# EAGLE design main_board_v2.3 (EAGLE 7.7.0)
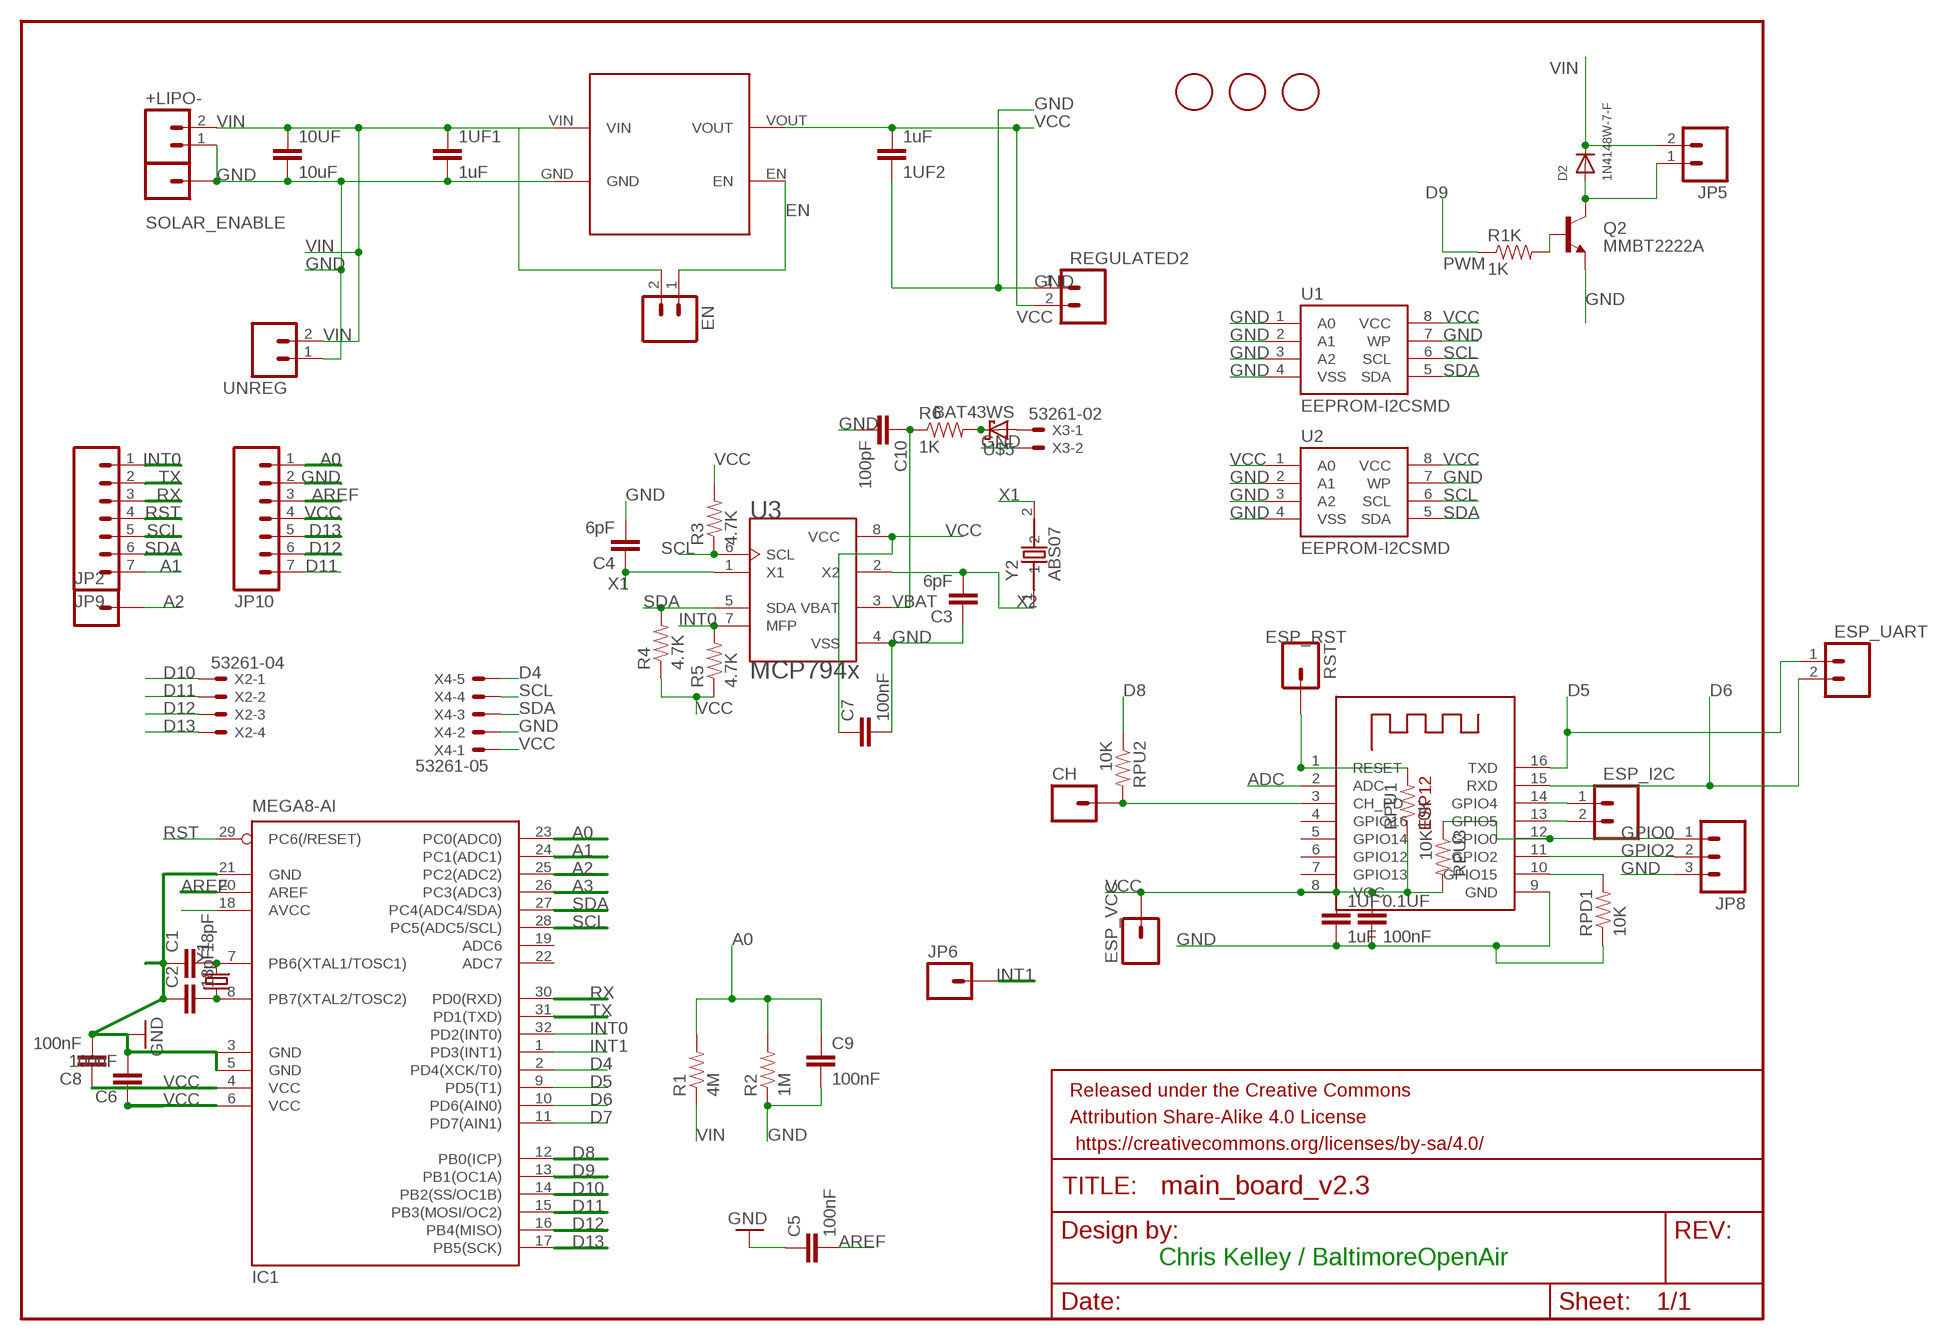
[diagram p0: schematic, sheet 1]

## Parts
0.1UF  100nF  CAP0603-CAP  [0603-CAP]
1UF  1uF  CAP0603-CAP  [0603-CAP]
1UF1  1uF  CAP0603-CAP  [0603-CAP]
1UF2  1uF  CAP0603-CAP  [0603-CAP]
10UF  10uF  CAP0805  [0805]
+LIPO-  M02PTH  [1X02]
C1  18pF  CAP0603-CAP  [0603-CAP]
C2  18pF  CAP0603-CAP  [0603-CAP]
C3  6pF  CAP0603-CAP  [0603-CAP]
C4  6pF  CAP0603-CAP  [0603-CAP]
C5  100nF  CAP0603-CAP  [0603-CAP]
C6  100nF  CAP0603-CAP  [0603-CAP]
C7  100nF  CAP0603-CAP  [0603-CAP]
C8  100nF  CAP0603-CAP  [0603-CAP]
C9  100nF  CAP0603-CAP  [0603-CAP]
C10  100pF  CAP0603-CAP  [0603-CAP]
CH  M01PTH  [1X01]
D2  1N4148W-7-F  DIODESOD-123  [SOD-123]
EN  M02PTH  [1X02]
ESP_I2C  M02PTH  [1X02]
ESP_UART  M02PTH  [1X02]
ESP_VCC  M01PTH  [1X01]
FRAME1  FRAME-LETTER  [CREATIVE_COMMONS]
IC1  MEGA8-AI  [TQFP32-08]
JP2  M01PTH  [1X01]
JP5  M02-JST-2MM-SMT  [JST-2-SMD]
JP6  M01PTH  [1X01]
JP8  M03PTH  [1X03]
JP9  M07  [1X07]
JP10  M07  [1X07]
Q2  MMBT2222A  TRANSISTOR_NPNMMBT2222A  [SOT23-3]
R1  4M  RESISTOR0603  [0603-RES]
R1K  1K  RESISTOR0603-RES  [0603-RES]
R2  1M  RESISTOR0603  [0603-RES]
R3  4.7K  RESISTOR0603-RES  [0603-RES]
R4  4.7K  RESISTOR0603-RES  [0603-RES]
R5  4.7K  RESISTOR0603-RES  [0603-RES]
R6  1K  RESISTOR0603-RES  [0603-RES]
REGULATED2  M02PTH  [1X02]
RPD1  10K  RESISTOR0603-RES  [0603-RES]
RPU1  10K  RESISTOR0603-RES  [0603-RES]
RPU2  10K  RESISTOR0603-RES  [0603-RES]
RPU3  10K  RESISTOR0603-RES  [0603-RES]
RST  M01PTH  [1X01]
SOLAR_ENABLE  M01PTH  [1X01]
U1  EEPROM-I2CSMD  [SO08]
U2  EEPROM-I2CSMD  [SO08]
U3  MCP794x  MCP7940M-I/SN  [SOIC127P600X175-8N]
U$3  FIDUCIAL  [FIDUCIAL_1MM]
U$4  AP2112K  [AP2112K-SOT23-5]
U$5  BAT43WS  [BAT43WS]
U$6  FIDUCIAL  [FIDUCIAL_1MM]
U$7  FIDUCIAL  [FIDUCIAL_1MM]
UNREG  M02PTH  [1X02]
X1  ESP-12  [ESP-12]
X2  53261-04  [53261-04]
X3  53261-02  [53261-02]
X4  53261-05  [53261-05]
Y1  CRYSTAL5X3  [CRYSTAL-SMD-5X3]
Y2  ABS07  ABS07-32.768KHZ-T  [XTAL320X150X90]

## Nets
A0: C9.1 IC1.23(PC0(ADC0)) JP10.1 R1.2 R2.2
A1: IC1.24(PC1(ADC1)) JP9.7
A2: IC1.25(PC2(ADC2)) JP2.1
A3: IC1.26(PC3(ADC3))
ADC: X1.2(ADC)
AREF: C5.2 IC1.20(AREF) JP10.3
CH_PD: CH.1 RPU2.2 X1.3(CH_PD)
D4: IC1.2(PD4(XCK/T0)) X4.5
D5: ESP_UART.1 IC1.9(PD5(T1)) X1.16(TXD)
D6: ESP_UART.2 IC1.10(PD6(AIN0)) X1.15(RXD)
D7: IC1.11(PD7(AIN1))
D8: IC1.12(PB0(ICP)) RPU2.1
D9: IC1.13(PB1(OC1A)) R1K.1
D10: IC1.14(PB2(SS/OC1B)) X2.1
D11: IC1.15(PB3(MOSI/OC2)) JP10.7 X2.2
D12: IC1.16(PB4(MISO)) JP10.6 X2.3
D13: IC1.17(PB5(SCK)) JP10.5 X2.4
EN: EN.1 U$4.EN
ESP_RST: RPU1.2 RST.1 X1.1(RESET)
GND: 0.1UF.2 1UF1.2 1UF2.1 1UF.2 10UF.2 +LIPO-.1 C1.1 C2.1 C3.1 C4.2 C5.1 C6.2 C7.2 C8.2 C9.2 C10.2 IC1.3(GND) IC1.5(GND) IC1.21(GND) JP8.3 JP10.2 Q2.2(E) R2.1 REGULATED2.1 RPD1.1 SOLAR_ENABLE.1 U1.1(A0) U1.2(A1) U1.3(A2) U1.4(VSS) U1.7(WP) U2.2(A1) U2.3(A2) U2.4(VSS) U2.7(WP) U3.4(VSS) U$4.GND UNREG.1 X1.9(GND) X3.2 X4.2
GPIO0: JP8.1 RPU3.1 X1.12(GPIO0)
GPIO2: JP8.2 X1.11(GPIO2)
GPIO15: RPD1.2 X1.10(GPIO15)
INT0: IC1.32(PD2(INT0)) JP9.1 R5.2 U3.7(MFP)
INT1: IC1.1(PD3(INT1)) JP6.1
N$1: D2.A JP5.1 Q2.3(C)
N$2: U$5.PIN1(C) X3.1
N$3: ESP_I2C.1 X1.14(GPIO4)
N$4: R6.2 U$5.PIN2(A)
N$5: ESP_I2C.2 X1.13(GPIO5)
PWM: Q2.1(B) R1K.2
Q1: C2.2 IC1.8(PB7(XTAL2/TOSC2)) Y1.1
Q2: C1.2 IC1.7(PB6(XTAL1/TOSC1)) Y1.3
RST: IC1.29(PC6(/RESET)) JP9.4
RX: IC1.30(PD0(RXD)) JP9.3
SCL: IC1.28(PC5(ADC5/SCL)) JP9.5 R3.1 U1.6(SCL) U2.6(SCL) U3.6(SCL) X4.4
SDA: IC1.27(PC4(ADC4/SDA)) JP9.6 R4.2 U1.5(SDA) U2.5(SDA) U3.5(SDA) X4.3
TX: IC1.31(PD1(TXD)) JP9.2
VBAT: C10.1 R6.1 U3.3(VBAT)
VCC: 0.1UF.1 1UF2.2 1UF.1 C6.1 C7.1 C8.1 ESP_VCC.1 IC1.4(VCC) IC1.6(VCC) IC1.18(AVCC) JP10.4 R3.2 R4.1 R5.1 REGULATED2.2 RPU1.1 RPU3.2 U1.8(VCC) U2.1(A0) U2.8(VCC) U3.8(VCC) U$4.VOUT X1.8(VCC) X4.1
VIN: 1UF1.1 10UF.1 +LIPO-.2 D2.C EN.2 JP5.2 R1.1 U$4.VIN UNREG.2
X1: C4.1 U3.1(X1) Y2.2
X2: C3.2 U3.2(X2) Y2.1
Unconnected: IC1.19(ADC6) IC1.22(ADC7) X1.4(GPIO16) X1.5(GPIO14) X1.6(GPIO12) X1.7(GPIO13)

## Notes on the sheet
- Chris Kelley / BaltimoreOpenAir

## Library data of the parts
0.1UF 1UF 1UF1 1UF2 10UF C3 C4 C7 C9 C10 = SparkFun-Passives:CAP: Capacitor Standard 0603 ceramic capacitor, and 0.1" leaded capacitor.
+LIPO- EN ESP_I2C ESP_UART REGULATED2 UNREG = SparkFun-Connectors:M02: Standard 2-pin 0.1" header. Use with - straight break away headers ( PRT-00116) - right angle break away headers (PRT-00553) - swiss pins (PRT-00743) - machine pins (PRT-00117) - female headers (PRT-00115) Molex polarized connector foot print use with: PRT-08233 with associated crimp pins and housings. 2.54_SCREWTERM for use with PRT-10571. 3.5mm Screw Terminal footprints for PRT-08084 5mm Screw Terminal footprints for use with PRT-08432
C1 C2 C5 C6 C8 = SparkFun:CAP: Capacitor Standard 0603 ceramic capacitor, and 0.1" leaded capacitor.
CH ESP_VCC JP2 JP6 RST SOLAR_ENABLE = SparkFun-Connectors:M01: Header 1 Standard 1-pin 0.1" header. Use with straight break away headers (SKU : PRT-00116), right angle break away headers (PRT-00553), swiss pins (PRT-00743), machine pins (PRT-00117), and female headers (PRT-00115).
D2 = adafruit:DIODE: Diode SMADIODE - SMA Surface Mount Package 20V 1A Schottky Diode Digikey: 641-1014-6-ND DO-1N4148 - Through Hole Small Current Diode SOD-123 20V 1 A (.5mV Vf) Schottky Diode - Digikey: MBRX120TPMSCT-ND SOD-323 10V 570mA (.38mV Vf, 3ns) Schottky Diode - Digikey: ZLLS410CT-ND SOD-523 30V 30mA Schottky Diode (RB751S-40TE61) - Digikey: RB751S-40TE61CT-ND SOT23-R/W - SOT23 Package (R = Solder Paste/Reflow Ovens, W = Hand-Soldering) BAT54Film 40V 300mA - Digikey: 497-7162-1-ND
FRAME1 = SparkFun-Aesthetics:FRAME-LETTER: Schematic Frame Standard 8.5x11 US Letter frame
IC1 = atmel:MEGA8: MICROCONTROLLER 8 Kbytes FLASH, 1 kbytes SRAM, 512 bytes EEPROM, USART, 6-channel 10 bit ADC, 2-channel 8 bit ADC Pin compatible with Atmega48, ATMega88, ATMega168 Source: avr.lbr; MPN: ATMEGA8-16AU; OC_FARNELL: 9171371; OC_NEWARK: 73M8863
JP5 = SparkFun-Connectors:M02: Standard 2-pin 0.1" header. Use with - straight break away headers ( PRT-00116) - right angle break away headers (PRT-00553) - swiss pins (PRT-00743) - machine pins (PRT-00117) - female headers (PRT-00115) Molex polarized connector foot print use with: PRT-08233 with associated crimp pins and housings. 2.54_SCREWTERM for use with PRT-10571. 3.5mm Screw Terminal footprints for PRT-08084 5mm Screw Terminal footprints for use with PRT-08432; PROD_ID: CONN-11443
JP8 = SparkFun-Connectors:M03: Header 3 Standard 3-pin 0.1" header. Use with straight break away headers (SKU : PRT-00116), right angle break away headers (PRT-00553), swiss pins (PRT-00743), machine pins (PRT-00117), and female headers (PRT-00115). Molex polarized connector foot print use with SKU : PRT-08232 with associated crimp pins and housings.
JP9 JP10 = SparkFun:M07: Header 7 Standard 7-pin 0.1" header. Use with straight break away headers (SKU : PRT-00116), right angle break away headers (PRT-00553), swiss pins (PRT-00743), machine pins (PRT-00117), and female headers (PRT-00115). NOTES ON THE VARIANTS LOCK and LOCK_LONGPADS... This footprint was designed to help hold the alignment of a through-hole component (i.e. 7-pin header) while soldering it into place. You may notice that each hole has been shifted either up or down by 0.005 of an inch from it's more standard position (which is usually a perfectly straight line). This slight alteration caused the pins (the squares in the middle) to touch the edges of the holes. Because they are alternating, it causes a "brace" to hold the header in place. 0.005 has proven to be the perfect amount of "off-center" position when using our standard breakaway headers. Although looks a little odd when you look at the bare footprint, once you have a header in there, the alteration is very hard to notice. Also, if you push a header all the way into place, it is covered up entirely on the bottom side. This idea of altering the position of holes to aid alignment will be further integrated into the Sparkfun Library for other footprints. It can help hold any component with 3 or more connection pins.
Q2 = SparkFun-DiscreteSemi:TRANSISTOR_NPN: Generic NPN BJT MMBT2222A - TRANS-08049 (SOT-23, 1A 40V) MPSA42 - TRANS-09116 (SOT-23, 500mA 300V) MMBT5088LT1G - TRANS-11160 (SOT-23, 50 mA 30V) BC547 - COM-08928 <http://www.sparkfun.com/products/8928> (TO-92 45V 100mA) (1.Collector 2.Base 3.Emitter) 2N3904 - COM-00521 <http://www.sparkfun.com/products/521> (TO-92 40V 200mA) (1.Emitter 2.Base 3.Collector) P2N2222A - COM-12852 <http://www.sparkfun.com/products/12852> (TO-92 40V 600mA) (1.Collector 2.Base 3.Emitter); PROD_ID: TRANS-08049
R1 R2 = SparkFun-Resistors:RESISTOR: Resistor Basic schematic elements and footprints for 0603, 1206, and PTH resistors.
R1K R3-R6 RPD1 RPU1-RPU3 = SparkFun-Passives:RESISTOR: Resistor Basic schematic elements and footprints for 0603, 1206, and PTH resistors.
U1 U2 = SparkFun-DigitalIC:EEPROM-I2C: I2C EEPROM chips, 24LC256 (and others)
U3 = MCP7940M-I_SN:MCP7940M-I/SN: MCP7940M Series 5.5 V 64 byte I2C Real-Time Clock/Calendar with SRAM - SOIC-8; AVAILABILITY: Good; DESCRIPTION: MCP7940M Series 5.5 V 64 byte I2C Real-Time Clock/Calendar with SRAM - SOIC-8; MF: Microchip; MP: MCP7940M-I/SN; PACKAGE: SOIC-8 Microchip; PRICE: 0.62 USD
U$3 U$6 U$7 = adafruit:FIDUCIAL: For use by pick and place machines to calibrate the vision/machine, 1mm By microbuilder.eu
U$4 = TPL5111DDCR:AP2112K
U$5 = BAT43WS:BAT43WS
X1 = adafruit:ESP-12
X2 = con-molex:53?-04: CONNECTOR wire to board 1.25 mm (.049 inch) pitch header; OC_FARNELL: 1125374; OC_NEWARK: unknown
X3 = con-molex:53?-02: CONNECTOR wire to board 1.25 mm (.049 inch) pitch header; OC_FARNELL: 1125373; OC_NEWARK: unknown
X4 = con-molex:53?-05: CONNECTOR wire to board 1.25 mm (.049 inch) pitch header; OC_FARNELL: 1433644; OC_NEWARK: unknown
Y1 = SparkFun:CRYSTAL: Crystals Various standard crystals. Proven footprints. Spark Fun Electronics SKU : COM-00534
Y2 = ABS07-32.768KHZ-T:ABS07-32.768KHZ-T: ABS07 Series 32.768 kHz ±20 ppm 12.5 pF -40 to +85 °C SMT Low Profile Crystal; AVAILABILITY: Good; DESCRIPTION: ABS07 Series 32.768 kHz %C2%B120 ppm 12.5 pF -40 to %2B85 %C2%B0C SMT Low Profile Crystal; MF: Abracon; MP: ABS07-32.768KHZ-T; PACKAGE: 0805 Abracon; PRICE: 0.44 USD

## Board
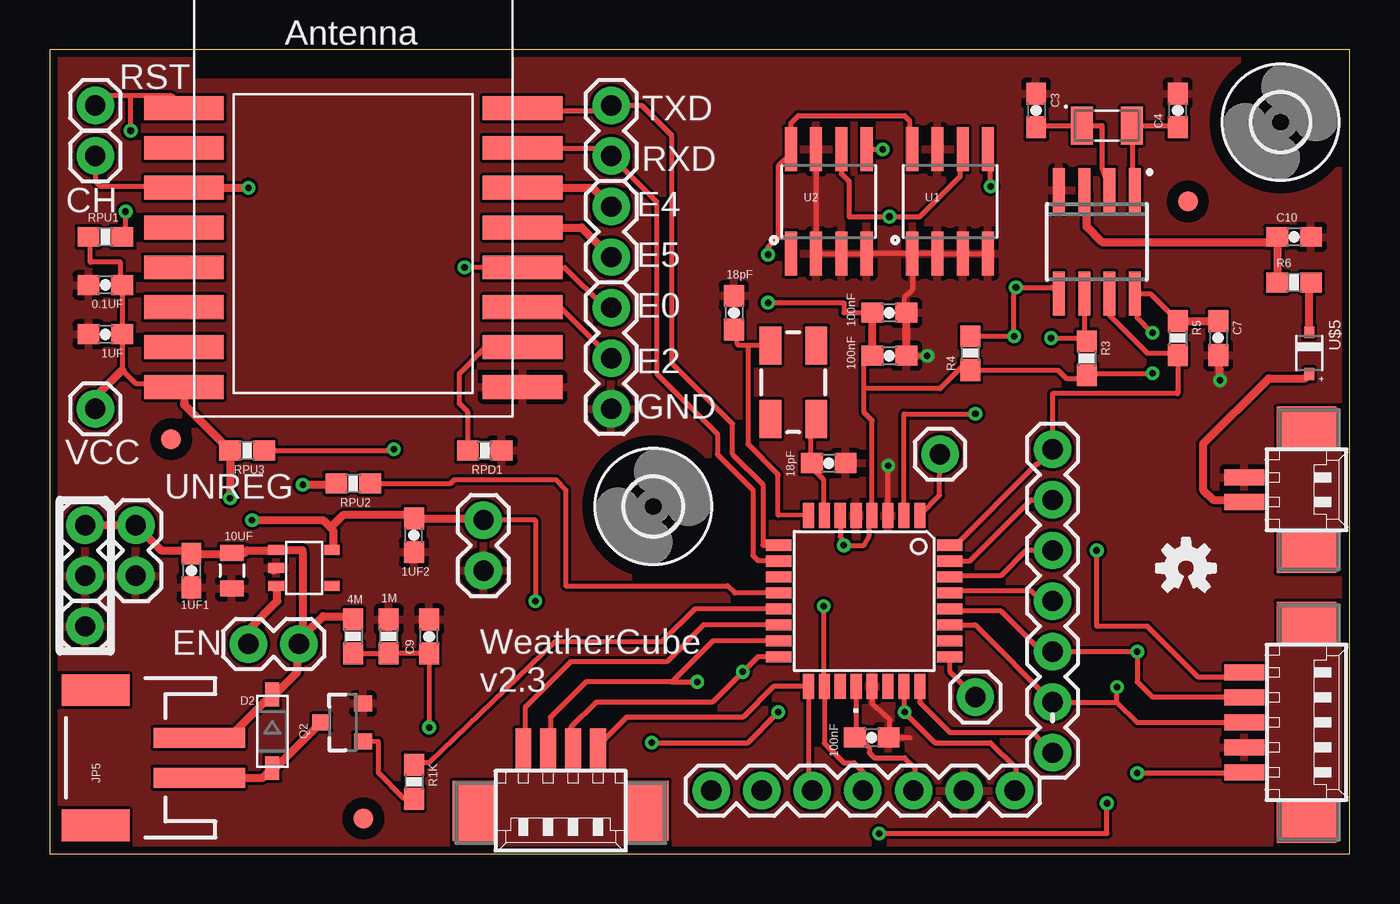
[diagram p1: board, top side]
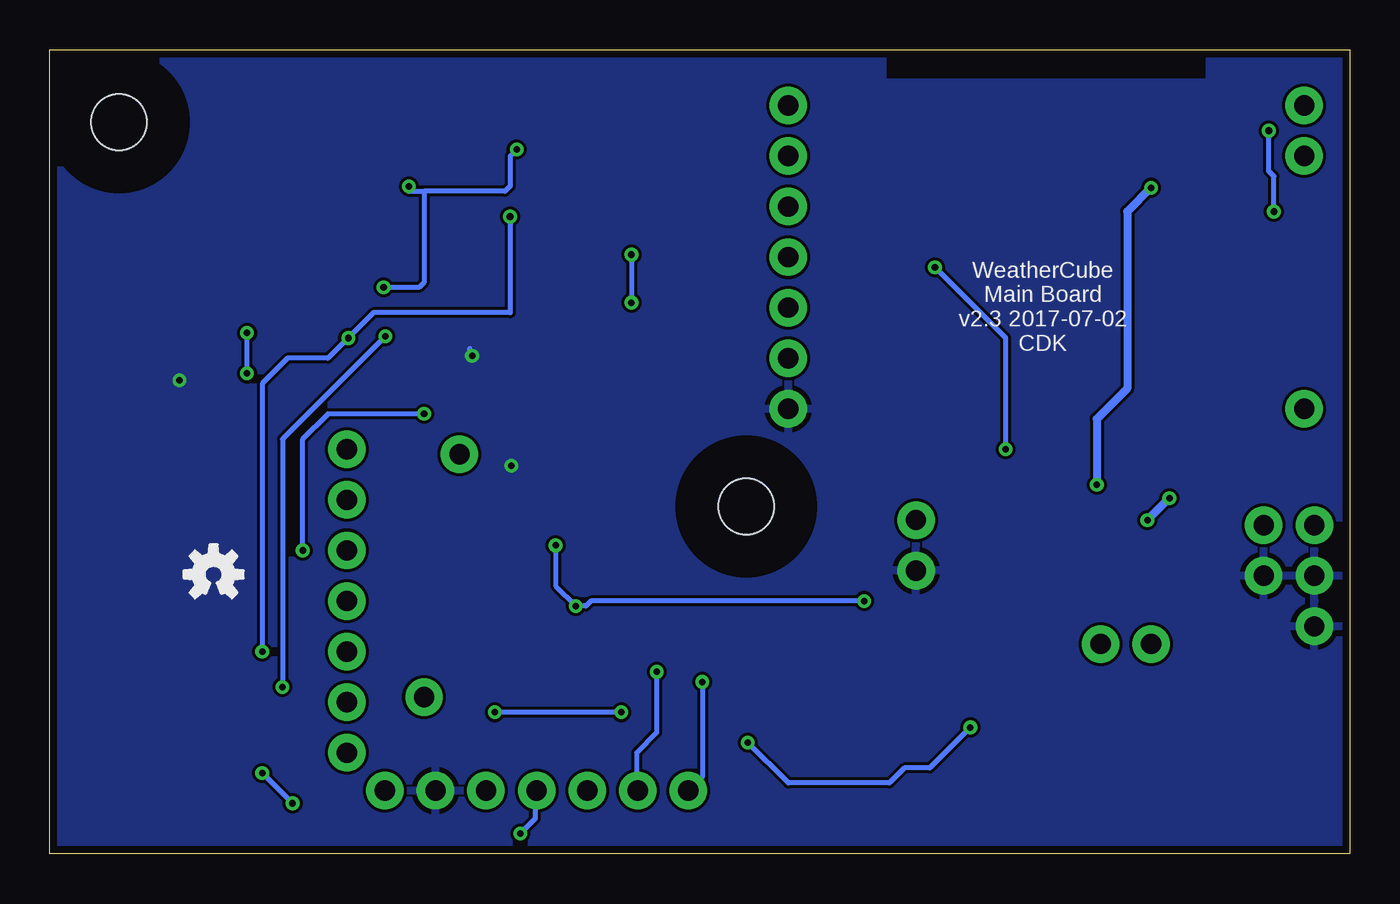
[diagram p2: board, bottom side, seen from below]

Size 65.28 x 40.39 mm. Coordinates in mm from the lower left corner, seen from the top.
Outline: 0,0 65.28,0 65.28,40.39 0,40.39 0,0
Copper layers (1*16): Top 0.0356mm / dielectric 1.5011mm / Bottom 0.0356mm
Design rules "default *": minimum track width 6mil, minimum drill 13mil, track to track 6mil, track to pad 6mil, pad to pad 6mil, via to via 6mil, smd to smd 6mil, copper to edge 15mil, drill to drill 6mil, minimum pad ring 7mil, minimum via ring 7mil, stop-mask expansion 4mil, vias tented up to drill 15mil, thermal gap 10mil

### Footprints (pad centres in the part's own frame; a part is rotated, then mirrored left to right if it is on the bottom)
0603-CAP = smd 1.1 x 1: 1 -0.85,0; 2 0.85,0
0805 = smd 0.8 x 1.2: 1 -0.9,0; 2 0.9,0
1X02 = drill 1.016 pad 1.88: 1 0,0; 2 2.54,0
1X01 = drill 1.016 pad 1.88: 1 0,0
SOD-123 = smd 1.2 x 0.7: A 1.85,0; C -1.85,0
TQFP32-08 = smd 1.27 x 0.559: 1 -4.293,2.8; 2 -4.293,2; 3 -4.293,1.2; 4 -4.293,0.4; 5 -4.293,-0.4; 6 -4.293,-1.2; 7 -4.293,-2; 8 -4.293,-2.8; 17 4.293,-2.8; 18 4.293,-2; 19 4.293,-1.2; 20 4.293,-0.4; 21 4.293,0.4; 22 4.293,1.2; 23 4.293,2; 24 4.293,2.8 | smd 0.559 x 1.27: 9 -2.8,-4.293; 10 -2,-4.293; 11 -1.2,-4.293; 12 -0.4,-4.293; 13 0.4,-4.293; 14 1.2,-4.293; 15 2,-4.293; 16 2.8,-4.293; 25 2.8,4.293; 26 2,4.293; 27 1.2,4.293; 28 0.4,4.293; 29 -0.4,4.293; 30 -1.2,4.293; 31 -2,4.293; 32 -2.8,4.293
JST-2-SMD = smd 1 x 4.6: 1 -1,-3.7; 2 1,-3.7 | smd 1.6 x 3.4: NC1 -3.4,1.5; NC2 3.4,1.5
1X03 = drill 1.016 pad 1.88: 1 0,0; 2 2.54,0; 3 5.08,0
1X07 = drill 1.016 pad 1.88: 1 0,0; 2 2.54,0; 3 5.08,0; 4 7.62,0; 5 10.16,0; 6 12.7,0; 7 15.24,0
SOT23-3 = smd 0.8 x 0.9: 1 -0.95,-1; 2 0.95,-1; 3 0,1.1
0603-RES = smd 1.1 x 1: 1 -0.85,0; 2 0.85,0
SO08 = smd 0.61 x 2.21: 1 -1.905,-2.616; 2 -0.635,-2.616; 3 0.635,-2.616; 4 1.905,-2.616; 5 1.905,2.616; 6 0.635,2.616; 7 -0.635,2.616; 8 -1.905,2.616
SOIC127P600X175-8N = smd 2.2 x 0.6: 1 -2.6,1.905; 2 -2.6,0.635; 3 -2.6,-0.635; 4 -2.6,-1.905; 5 2.6,-1.905; 6 2.6,-0.635; 7 2.6,0.635; 8 2.6,1.905
2,8 = hole 2.8: 0,0
FIDUCIAL_1MM = smd 1 x 1: 1 0,0
AP2112K-SOT23-5 = smd 0.8 x 0.5: EN 0,0; GND 0,0.9; NC 2.8,0; VIN 0,1.8; VOUT 2.8,1.8
BAT43WS = smd 0.6 x 0.5: PIN1 1.05,0; PIN2 -1.05,0
ESP-12 = smd 4 x 1.2: 1 -8.5,4.5; 2 -8.5,2.5; 3 -8.5,0.5; 4 -8.5,-1.5; 5 -8.5,-3.5; 6 -8.5,-5.5; 7 -8.5,-7.5; 8 -8.5,-9.5; 9 8.5,-9.5; 10 8.5,-7.5; 11 8.5,-5.5; 12 8.5,-3.5; 13 8.5,-1.5; 14 8.5,0.5; 15 8.5,2.5; 16 8.5,4.5
53261-04 = smd 0.8 x 2: 1 1.875,-2.5; 2 0.625,-2.5; 3 -0.625,-2.5; 4 -1.875,-2.5 | smd 2.1 x 3: S1 4.375,0.625; S2 -4.375,0.625
53261-02 = smd 0.8 x 2: 1 0.625,-2.5; 2 -0.625,-2.5 | smd 2.1 x 3: S1 3.125,0.625; S2 -3.125,0.625
53261-05 = smd 0.8 x 2: 1 2.5,-2.5; 2 1.25,-2.5; 3 0,-2.5; 4 -1.25,-2.5; 5 -2.5,-2.5 | smd 2.1 x 3: S1 5,0.625; S2 -5,0.625
CRYSTAL-SMD-5X3 = smd 1.9 x 1.1: 1 -1.85,-1.15; 2 1.85,-1.15; 3 1.85,1.15; 4 -1.85,1.15
XTAL320X150X90 = smd 1.1 x 1.9: 1 -1.25,0; 2 1.25,0

### Placement (x,y rotation side)
0.1UF  2.79,28.57 180 top
1UF  2.79,26.1 180 top
1UF1  7.11,14.22 270 top
1UF2  18.29,16 90 top
10UF  9.14,14.22 270 top
+LIPO-  4.32,13.97 90 top
C1  39.12,19.62 180 top
C2  34.35,27.18 270 top
C3  49.53,37.34 270 top
C4  56.64,37.34 90 top
C5  41.27,5.84 180 top
C6  42.16,27.18 0 top
C7  58.67,25.91 270 top
C8  42.16,25.02 0 top
C9  19.05,10.92 90 top
C10  62.48,30.99 0 top
CH  2.29,35.05 0 top
D2  11.18,6.16 270 top
EN  9.97,10.54 0 top
ESP_I2C  28.19,32.51 270 top
ESP_UART  28.19,37.59 270 top
ESP_VCC  2.29,22.35 0 top
FRAME1  3.3,-11.18 0 top  (outside the outline)
IC1  40.89,12.7 270 top
JP2  46.48,7.87 0 top
JP5  3.81,4.83 90 top
JP6  44.7,20.07 0 top
JP8  28.19,27.43 270 top
JP9  50.36,20.32 270 top
JP10  48.45,3.17 180 top
Q2  14.73,6.6 90 top
R1  15.24,10.92 270 top
R1K  18.29,3.62 270 top
R2  17.02,10.92 270 top
R3  52.07,24.89 270 top
R4  46.23,25.15 90 top
R5  56.64,25.91 270 top
R6  62.48,28.7 0 top
REGULATED2  21.78,14.22 90 top
RPD1  21.84,20.26 180 top
RPU1  2.79,30.99 0 top
RPU2  15.24,18.61 180 top
RPU3  9.91,20.26 180 top
RST  2.29,37.59 0 top
SOLAR_ENABLE  1.78,11.43 0 top
U1  45.21,32.77 0 top
U2  39.12,32.77 0 top
U3  52.58,30.73 270 top
U$1  [2,8]  30.31,17.45 0 top
U$2  [OSHW-LOGO-S]  57.05,14.35 0 top
U$3  57.15,32.77 0 top
U$4  11.37,13.46 0 top
U$5  63.25,25.15 270 top
U$6  15.75,1.78 0 top
U$7  6.1,20.83 0 top
U$8  [OSHW-LOGO-S]  57.05,14.03 0 bottom
U$9  [2,8]  61.81,36.75 0 top
UNREG  1.78,13.97 90 top
X1  15.24,32.96 0 top
X2  25.65,2.79 180 top
X3  62.48,18.29 270 top
X4  62.48,6.6 270 top
Y1  37.34,23.69 270 top
Y2  53.09,36.58 0 top

### Tracks (layer width: path | path; a pad name or v marks a point on that pad's centre or on a via)
A0  (via drill 0.33)
  Top 0.254: R1.2 R2.2 C9.1 v19.05,6.35 | v30.23,5.59 35.05,5.59 v36.58,7.11 | IC1.23 42.93,8.38 v42.93,7.11 44.45,5.59 47.24,5.59 48.51,4.32 48.51,3.24 JP10.1
  Bottom 0.254: v19.05,6.35 21.08,4.32 22.35,4.32 23.11,3.56 28.19,3.56 v30.23,5.59 | v36.58,7.11 v42.93,7.11
A1
  Top 0.254: IC1.24 43.69,7.61 45.21,6.1 49.34,6.1 JP9.7
A2
  Top 0.254: IC1.25 45.19,9.17 JP2.1
AREF
  Top 0.254: IC1.20 40.49,6.17 C5.2 40.64,5.84 41.15,5.33 41.15,5.08 41.4,4.83 42.93,4.83 43.43,4.32 43.43,3.24 JP10.3
CH_PD  (via drill 0.33)
  Top 0.254: CH.1 2.29,33.78 2.54,33.53 6.67,33.53 X1.3
  Top 0.406: X1.3 v9.98,33.46 | v12.7,18.54 14.33,18.54 RPU2.2
  Bottom 0.406: v9.98,33.46 11.18,32.26 11.18,23.37 12.7,21.84 v12.7,18.54
D4  (via drill 0.33)
  Top 0.254: IC1.2 42.89,22.1 v46.48,22.1 | v52.58,15.24 52.58,11.43 55.12,11.43 57.66,8.89 59.94,8.89 X4.5
  Bottom 0.254: v52.58,15.24 52.58,20.83 51.31,22.1 v46.48,22.1
D5
  Top 0.254: IC1.9 35.81,15.49 35.81,18.54 34.29,20.07 34.29,21.59 31.24,24.64 31.24,36.07 29.72,37.59 ESP_UART.1 27.94,37.34 23.37,37.34 23.11,37.59
  Top 0.406: 23.11,37.59 23.61,37.59 X1.16
D6
  Top 0.254: 25.4,35.31 25.04,35.46 X1.15 27.79,35.46 ESP_UART.2 30.48,32.77 30.48,24.13 33.53,21.08 33.53,20.07 35.31,18.29 35.31,14.99 35.56,14.73 36.57,14.73 IC1.10
  Top 0.406: 23.64,35.56 X1.15
D8
  Top 0.254: IC1.12 34.4,13.1 34.04,13.46 25.91,13.46 25.91,18.29 25.4,18.8 20.32,18.8 20.13,18.61 RPU2.1
D9
  Top 0.254: IC1.13 32.4,12.3 30.73,10.67 25.4,10.67 19.05,4.57 18.39,4.57 R1K.1
D10
  Top 0.254: IC1.14 32.84,11.5 30.99,9.65 26.16,9.65 23.88,7.37 23.88,5.39 X2.1
D11  (via drill 0.33)
  Top 0.254: IC1.15 33.31,10.7 31.24,8.64 | 31.24,8.64 26.92,8.64 25.15,6.86 25.15,5.41 X2.2 | 31.24,8.64 v32.51,8.64
  Bottom 0.254: v32.51,8.64 32.51,3.87 JP10.7
D12  (via drill 0.33)
  Top 0.254: 36.13,9.9 IC1.16 35.55,9.9 v34.8,9.14 33.27,7.62 27.43,7.62 26.16,6.35 26.16,5.41 X2.3
  Bottom 0.254: v34.8,9.14 34.8,6.1 35.81,5.08 35.81,3.24 JP10.6
D13
  Top 0.254: X2.4 27.47,5.29 27.43,5.33 28.96,6.86 34.8,6.86 36.35,8.41 IC1.17 38.09,3.37 JP10.5
EN
  Top 0.406: U$4.EN 11.43,13.4 11.43,12.7 9.91,11.18 9.91,10.6 EN.1
ESP_RST  (via drill 0.33)
  Top 0.254: RPU1.2 3.81,30.99 v3.81,32.26 | RST.1 2.29,38.1 4.06,38.1 | 4.06,38.1 6.1,38.1 X1.1 | v4.06,36.32 4.06,38.1
  Bottom 0.254: v3.81,32.26 3.81,34.04 4.06,34.29 v4.06,36.32
GND  (via drill 0.33)
  Top 0.254: IC1.3 v42.09,19.49 | 41.15,8.55 IC1.21 41.29,7.55 42.16,6.79 42.16,5.84 | 43.2,5.82 41.91,5.82 42.16,5.84 | 42.16,5.84 C5.1 | U2.7 U2.2 U2.3 U2.4 U1.1 | 43.18,27.18 42.93,27.27 | 42.93,27.27 C6.2 | C8.2 v44.07,25.02 | 45.72,3.3 45.97,3.24 JP10.2 | 42.93,27.27 42.93,27.94 43.31,28.32 U1.1 | U1.1 U1.2 U1.3 U1.4
  Top 0.406: 9.56,13.37 10UF.2 9.09,13.37 | 11.23,14.22 U$4.GND | REGULATED2.1 21.27,14.48 | C8.2 C6.2 | C7.2 v58.76,23.79 | 18.24,15.1 1UF2.1
  Bottom 0.254: v44.07,25.02 44.2,25.4
  pour Bottom: -2.79,50.8 69.85,51.56 69.6,-5.08 -2.79,-5.08
  pour Top: -4.57,51.05 68.07,51.82 67.82,-4.83 -4.57,-4.83
GPIO0  (via drill 0.33)
  Top 0.254: RPU3.1 17.21,20.26 v17.27,20.32 | v20.83,29.46 22.73,29.46 X1.12 25.85,29.46 27.88,27.43 JP8.1
  Bottom 0.254: v17.27,20.32 17.27,25.91 v20.83,29.46
GPIO2
  Top 0.254: X1.11 24.61,27.46 25.4,27.43 25.65,27.43 JP8.2
GPIO15
  Top 0.254: RPD1.2 20.99,22.19 20.57,22.61 20.57,24.13 21.84,25.4 22.68,25.4 X1.10
INT0
  Top 0.254: IC1.32 45.44,15.47 49.53,19.56 49.59,19.56 JP9.1 50.35,23.11 56.64,23.11 R5.2 56.55,25.15 55.12,25.15 53.21,27.05 U3.7
INT1
  Top 0.254: IC1.1 44.68,18.01 JP6.1
N$1
  Top 0.406: JP5.1 10.69,3.83 D2.A 11.34,4.31 Q2.3
N$2
  Top 0.406: X3.1 59.87,17.78 58.42,17.78 57.91,18.29 57.91,20.57 61.21,23.88 63.03,23.88 U$5.PIN1
N$3
  Top 0.406: X1.14 27.25,33.46 ESP_I2C.1
N$4
  Top 0.406: R6.2 63.25,28.36 U$5.PIN2
N$5
  Top 0.406: X1.13 26.71,31.46 ESP_I2C.2
PWM
  Top 0.254: R1K.2 17.8,2.77 16.51,4.06 16.51,5.64 Q2.1
Q1
  Top 0.254: IC1.8 38.12,16.99 36.58,17.02 36.58,19.05 35.05,20.57 35.05,25.54 | 36.13,25.97 36.22,26.1 36.05,25.81 36.05,25.67 Y1.1 35.05,25.54 | 35.05,25.54 34.56,25.54 C2.2
Q2
  Top 0.254: Y1.3 38.19,21.28 38.19,19.7 C1.2 38.27,19.39 38.86,18.8 38.86,17.02 IC1.7
RST
  Top 0.254: JP9.4 49.78,12.7 49.28,13.21 45.3,13.21 IC1.29
RX
  Top 0.254: JP9.3 49.02,15.24 47.75,13.97 45.26,13.97 IC1.30
SCL  (via drill 0.33)
  Top 0.254: IC1.28 45.3,12.19 47.75,12.19 49.78,10.16 JP9.5 v54.61,10.16 54.61,8.64 55.37,7.87 59.71,7.87 X4.4 | U2.6 39.75,34.16 40.13,33.78 40.13,32 v42.16,32 43.69,32 45.72,34.04 45.72,35.26 U1.6 | U3.6 51.94,25.87 R3.1 51.9,25.91 v50.29,25.91
  Bottom 0.254: v42.16,32 42.16,27.18 49.02,27.18 v50.29,25.91 51.31,24.89 53.34,24.89 54.61,23.62 v54.61,10.16
SDA  (via drill 0.33)
  Top 0.254: IC1.27 46.48,11.5 JP9.6 53.59,7.62 | U2.5 v41.83,35.38 | v47.24,33.53 47.24,34.8 47.17,34.87 U1.5 | U3.5 50.61,28.19 50.29,28.45 v48.51,28.45 48.43,28.28 v48.43,26 R4.2 | 53.59,7.62 v53.59,8.38 | 53.59,7.62 54.61,6.6 X4.3
  Bottom 0.254: v41.83,35.38 42.16,35.05 42.16,33.53 42.42,33.27 46.48,33.27 | v47.24,33.53 47.24,33.27 46.48,33.27 | 46.48,33.27 46.48,28.7 46.74,28.45 v48.51,28.45 | v48.43,26 53.59,20.83 v53.59,8.38
TX
  Top 0.254: IC1.31 46.2,14.7 49.28,17.78 JP9.2
VBAT
  Top 0.406: R6.1 C10.1 61.21,30.73 52.83,30.73 52.07,31.5 52.07,33.21 U3.3
VCC  (via drill 0.33)
  Top 0.254: IC1.6 39.69,15.93 v39.88,15.49 40.89,15.49 41.15,16 41.15,16.85 IC1.4 41.29,21.76 40.89,22.16 40.89,23.37 | v38.86,12.45 38.86,8.44 IC1.18 38.89,5.56 39.88,4.57 40.39,4.57 40.89,4.06 40.89,3.24 JP10.4 | v24.38,12.7 24.38,16.76 REGULATED2.2 | U1.8 43.18,35.51 43.18,36.83 42.93,37.08 37.59,37.08 37.21,36.7 U2.8 37.21,35.18 36.58,34.54 36.58,30.99 | v36.07,27.69 39.88,27.69 39.88,27.18 C6.1 | R5.1 55.27,28.13 U3.8 54.61,28.01 54.61,26.92 v55.37,26.16 | v55.37,24.13 52.07,24.13 R3.2 51.9,23.88 51.05,23.88 50.63,24.3 R4.1 45.89,24.55 44.7,23.37 40.89,23.37 | v53.09,2.54 53.09,1.02 v41.66,1.02 | 40.89,23.37 40.89,24.6 C8.1 | v54.61,4.06 59.77,4.06 X4.1 | v36.07,30.1 36.07,30.48 36.58,30.99 | 36.58,30.99 37.08,30.99 37.08,30.28 U2.1 | 0.1UF.1 1UF.1 3.64,24.3 4.32,23.62 6.57,23.62 X1.8 | 3.56,28.57 3.56,29.72 2.03,29.72 2.03,30.9 RPU1.1
  Top 0.406: C8.1 C6.1 | 18.24,16.9 1UF2.2 | R5.1 C7.1 | 1UF2.2 18.12,17.02 14.73,17.02 14.1,16.38 | 14.1,16.38 13.72,16.76 v10.16,16.76 | 14.1,16.38 14.22,16.26 14.22,15.32 U$4.VOUT | RPU1.1 2.03,30.99 | 3.56,28.57 0.1UF.1 | X1.8 6.74,22.57 RPU3.2 v9.06,17.87 | 1UF2.2 21.69,16.85 REGULATED2.2 | ESP_VCC.1 2.29,22.94 3.64,24.3
  Bottom 0.254: v39.88,15.49 39.88,13.46 v38.86,12.45 38.35,12.45 38.1,12.7 v24.38,12.7 | v36.07,30.1 v36.07,27.69 | v55.37,24.13 v55.37,26.16 | v53.09,2.54 v54.61,4.06 | v41.66,1.02 40.89,1.78 40.89,3.11 JP10.4
  Bottom 0.406: v9.06,17.87 v10.16,16.76
VIN
  Top 0.406: UNREG.2 +LIPO-.2 5.59,15.24 6.78,15.24 arc-45 7.07,15.12 1UF1.1 9.09,15.07 10UF.1 9.79,15.12 9.91,15.24 11.35,15.24 U$4.VIN 12.68,15.26 12.7,14.99 12.7,11.18 12.83,11.05 | JP5.2 8.99,5.83 D2.C 11.24,8.07 11.38,8.07 12.45,9.14 12.45,10.48 EN.2 12.51,10.73 12.83,11.05 | 12.83,11.05 13.72,11.94 15.2,11.94 R1.1
X1
  Top 0.254: U3.1 54.36,33.46 54.36,36.58 Y2.2 56.39,36.58 C4.1
X2
  Top 0.254: C3.2 49.78,36.58 Y2.1 52.83,36.58 52.83,34.48 U3.2

### Text on the board
tPlace: .
bPlace: WeatherCube / Main Board / v2.3 2017-07-02 / CDK
tNames: TXD | RXD | E4 | E5 | E0 | E2 | GND | VCC | WeatherCube / v2.3 | Chris Kelley / BaltimoreOpenAir